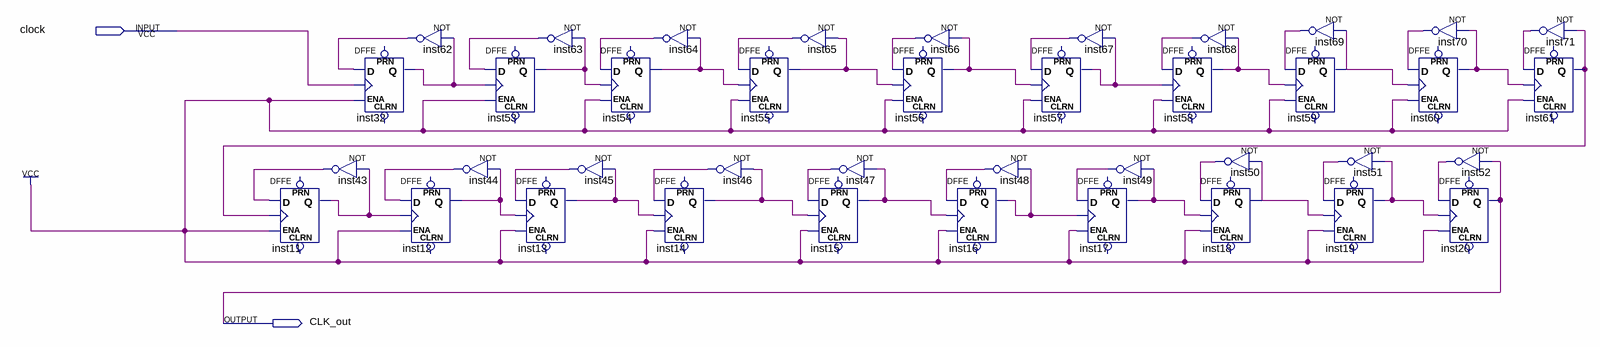
[diagram p0: schematic sheet]
// Quartus schematic clock.bdf as structural Verilog: 40 symbols, 2 pins
module clock (
  input  clock,
  output CLK_out
);

  wire inst11_q, inst12_q, inst13_q, inst14_q, inst15_q, inst16_q, inst17_q, inst18_q, inst19_q, inst32_q,
       inst43_out, inst44_out, inst45_out, inst46_out, inst47_out, inst48_out, inst49_out, inst50_out,
       inst51_out, inst52_out, inst53_q, inst54_q, inst55_q, inst56_q, inst57_q, inst58_q, inst59_q,
       inst60_q, inst61_q, inst62_out, inst63_out, inst64_out, inst65_out, inst66_out, inst67_out,
       inst68_out, inst69_out, inst70_out, inst71_out;

  DFFE inst11 (.D(inst43_out), .CLK(inst61_q), .ENA(1'b1), .Q(inst11_q));  // open: PRN, CLRN
  DFFE inst32 (.D(inst62_out), .CLK(clock), .ENA(1'b1), .Q(inst32_q));  // open: PRN, CLRN
  not inst43 (inst43_out, inst11_q);
  not inst62 (inst62_out, inst32_q);
  DFFE inst12 (.D(inst44_out), .CLK(inst11_q), .ENA(1'b1), .Q(inst12_q));  // open: PRN, CLRN
  DFFE inst53 (.D(inst63_out), .CLK(inst32_q), .ENA(1'b1), .Q(inst53_q));  // open: PRN, CLRN
  not inst44 (inst44_out, inst12_q);
  not inst63 (inst63_out, inst53_q);
  DFFE inst13 (.D(inst45_out), .CLK(inst12_q), .ENA(1'b1), .Q(inst13_q));  // open: PRN, CLRN
  DFFE inst54 (.D(inst64_out), .CLK(inst53_q), .ENA(1'b1), .Q(inst54_q));  // open: PRN, CLRN
  not inst45 (inst45_out, inst13_q);
  not inst64 (inst64_out, inst54_q);
  DFFE inst14 (.D(inst46_out), .CLK(inst13_q), .ENA(1'b1), .Q(inst14_q));  // open: PRN, CLRN
  DFFE inst55 (.D(inst65_out), .CLK(inst54_q), .ENA(1'b1), .Q(inst55_q));  // open: PRN, CLRN
  not inst46 (inst46_out, inst14_q);
  not inst65 (inst65_out, inst55_q);
  DFFE inst15 (.D(inst47_out), .CLK(inst14_q), .ENA(1'b1), .Q(inst15_q));  // open: PRN, CLRN
  not inst47 (inst47_out, inst15_q);
  not inst66 (inst66_out, inst56_q);
  DFFE inst56 (.D(inst66_out), .CLK(inst55_q), .ENA(1'b1), .Q(inst56_q));  // open: PRN, CLRN
  not inst48 (inst48_out, inst16_q);
  DFFE inst16 (.D(inst48_out), .CLK(inst15_q), .ENA(1'b1), .Q(inst16_q));  // open: PRN, CLRN
  DFFE inst57 (.D(inst67_out), .CLK(inst56_q), .ENA(1'b1), .Q(inst57_q));  // open: PRN, CLRN
  not inst67 (inst67_out, inst57_q);
  not inst49 (inst49_out, inst17_q);
  DFFE inst17 (.D(inst49_out), .CLK(inst16_q), .ENA(1'b1), .Q(inst17_q));  // open: PRN, CLRN
  DFFE inst58 (.D(inst68_out), .CLK(inst57_q), .ENA(1'b1), .Q(inst58_q));  // open: PRN, CLRN
  not inst68 (inst68_out, inst58_q);
  not inst50 (inst50_out, inst18_q);
  DFFE inst18 (.D(inst50_out), .CLK(inst17_q), .ENA(1'b1), .Q(inst18_q));  // open: PRN, CLRN
  not inst69 (inst69_out, inst59_q);
  DFFE inst59 (.D(inst69_out), .CLK(inst58_q), .ENA(1'b1), .Q(inst59_q));  // open: PRN, CLRN
  not inst51 (inst51_out, inst19_q);
  DFFE inst19 (.D(inst51_out), .CLK(inst18_q), .ENA(1'b1), .Q(inst19_q));  // open: PRN, CLRN
  not inst70 (inst70_out, inst60_q);
  DFFE inst60 (.D(inst70_out), .CLK(inst59_q), .ENA(1'b1), .Q(inst60_q));  // open: PRN, CLRN
  not inst52 (inst52_out, CLK_out);
  DFFE inst20 (.D(inst52_out), .CLK(inst19_q), .ENA(1'b1), .Q(CLK_out));  // open: PRN, CLRN
  not inst71 (inst71_out, inst61_q);
  DFFE inst61 (.D(inst71_out), .CLK(inst60_q), .ENA(1'b1), .Q(inst61_q));  // open: PRN, CLRN
endmodule
